# Altium schematic sheet peripherals.SchDoc
size A; SheetNumber: 2; SheetTotal: 2
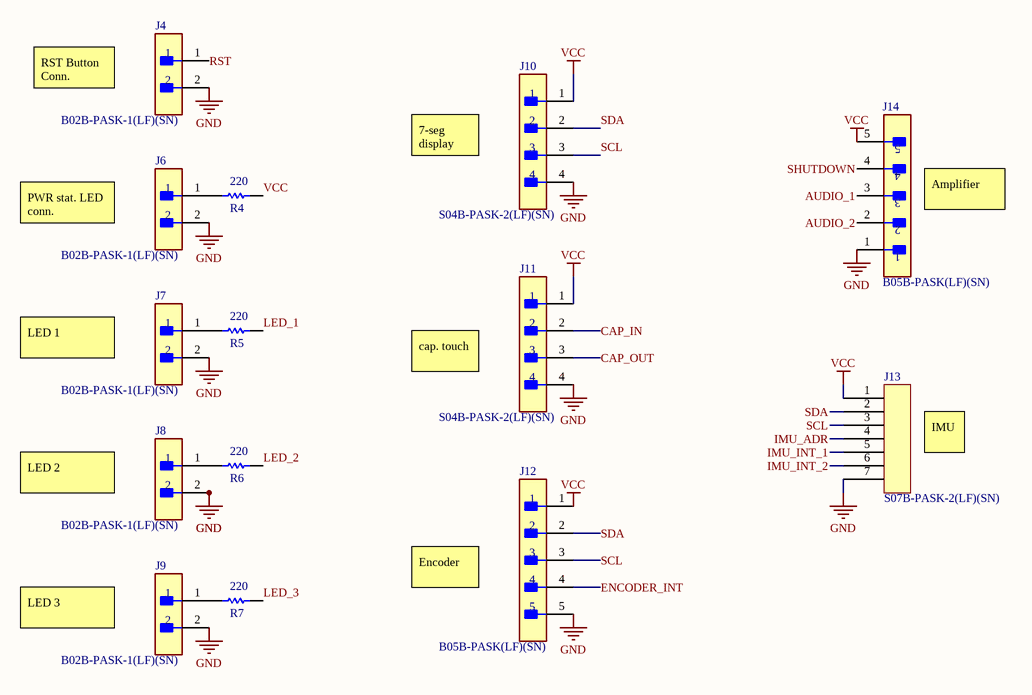
[diagram p0: peripherals.SchDoc]

## Parts
J4  B02B-PASK-1(LF)(SN)  [FP-B02B-PASK-1_LF_SN-MFG]
J6  B02B-PASK-1(LF)(SN)  [FP-B02B-PASK-1_LF_SN-MFG]
J7  B02B-PASK-1(LF)(SN)  [FP-B02B-PASK-1_LF_SN-MFG]
J8  B02B-PASK-1(LF)(SN)  [FP-B02B-PASK-1_LF_SN-MFG]
J9  B02B-PASK-1(LF)(SN)  [FP-B02B-PASK-1_LF_SN-MFG]
J10  S04B-PASK-2(LF)(SN)  [FP-S04B-PASK-2_LF_SN-MFG]
J11  S04B-PASK-2(LF)(SN)  [FP-S04B-PASK-2_LF_SN-MFG]
J12  B05B-PASK(LF)(SN)  [FP-B05B-PASK_LF_SN-MFG]
J13  S07B-PASK-2(LF)(SN)  [S07B-PASK-2(LF)(SN)-Footprint-1]
J14  B05B-PASK(LF)(SN)  [FP-B05B-PASK_LF_SN-MFG]
R4  220  [RESA60-630X240]
R5  220  [RESA60-630X240]
R6  220  [RESA60-630X240]
R7  220  [RESA60-630X240]

## Nets
GND: J4.2 J6.2 J7.2 J8.2 J9.2 J10.4 J11.4 J12.5 J13.7 J14.1
VCC: J10.1 J11.1 J12.1 J13.1 J14.5 R4.2
AUDIO_1: J14.3
AUDIO_2: J14.2
CAP_IN: J11.2
CAP_OUT: J11.3
ENCODER_INT: J12.4
IMU_ADR: J13.4
IMU_INT_1: J13.5
IMU_INT_2: J13.6
LED_1: R5.2
LED_2: R6.2
LED_3: R7.2
RST: J4.1
SCL: J10.3 J12.3 J13.3
SDA: J10.2 J12.2 J13.2
SHUTDOWN: J14.4
NetJ6_1: J6.1 R4.1
NetJ7_1: J7.1 R5.1
NetJ8_1: J8.1 R6.1
NetJ9_1: J9.1 R7.1

## Notes on the sheet
- RST Button Conn.
- 7-seg display
- PWR stat. LED conn.
- (near J14) Amplifier
- LED 1
- cap. touch
- LED 2
- (near J13) IMU
- LED 3
- Encoder

## Library data of the parts
J4 J6-J9 = CMP-17439-000415-1: CONN HEADER VERT 2POS 2MM; Number of Contacts: 2; Current Rating: 3A; Insulation Resistance: 1GR; Mated Stacking Heights: 14.9mm; Voltage Rating: 250V; Gender: Male; Pitch: 2mm; Orientation: Straight; Contact Finish - Mating: TIN; Mount: Through Hole; Contact Type: Male Pin; Number of Rows: 1; Fastening Type: Ramp; Series: PA; Connector Type: Header; Insulation Color: Natural; Flammability Rating: UL94 V-0; Material: Polybutylene; Contact Shape: Square; Contact Plating: Tin; Insulation Material: PBT; Max Operating Temperature: 85°C; Housing Color: White; Number of Positions: 2; Contact Material: Copper Alloy; Min Operating Temperature: -25°C; Lead Free: Lead Free; Contact Mating Length: 0.126inch; Termination: Solder; Packaging: Bulk; Color: Natural
J10 J11 = CMP-17439-000283-1: CONN HEADER R/A 4POS 2MM; Max Current Rating: 3A; Contact Resistance: 20mR; Max Voltage Rating (AC): 250V; Number of Positions: 4; Orientation: Right Angle; Contact Type: Male Pin; Insulation Material: PBT; Contact Shape: Square; Series: PA; Contact Mating Length: 0.126inch; Fastening Type: Ramp; Contact Material: Copper Alloy; Termination: Solder; Housing Color: White; Length: 10mm; Contact Plating: Copper; Packaging: Bulk; Max Operating Temperature: 85°C; Connector Type: Header; Number of Rows: 1; Flammability Rating: UL94 V-0; Min Operating Temperature: -25°C; Insulation Color: Natural; Current Rating: 3A; Depth: 11.7mm; Number of Contacts: 4; Mount: Through Hole; Color: Natural; Pitch: 2mm; Contact Finish - Mating: TIN; Lead Free: Lead Free; Voltage Rating: 250V
J12 J14 = CMP-17439-000143-1: CONN HEADER VERT 5POS 2MM; Number of Positions: 5; Voltage Rating: 250V; Gender: Male; Mated Stacking Heights: 14.9mm; Contact Material: Copper Alloy; Contact Type: Male Pin; Contact Finish - Mating: TIN; Insulation Material: PBT; Contact Plating: Tin; Contact Mating Length: 0.126inch; Fastening Type: Ramp; Contact Shape: Square; Packaging: Bulk; Color: Natural; Mount: Through Hole; Housing Color: White; Termination: Kinked Pin; Series: PA; Number of Rows: 1; Lead Free: Lead Free; Flammability Rating: UL94 V-0; Insulation Color: Natural; Number of Contacts: 5; Connector Type: Header; Pitch: 2mm
J13 = CMP-002-00091-1: Conn Shrouded Header HDR 7 POS 2mm Solder RA Thru-Hole Box
R4-R7 = CMP-009-00195-1: RES 1K OHM 1/4W 1% AXIAL; Resistance: 1kR; Voltage Rating (DC): 200V; Temperature Coefficient: 100ppm/°C; Lead Diameter: 0.6mm; Max Power Dissipation: 250mW; Voltage Rating: 250V; Min Operating Temperature: -55°C; Max Operating Temperature: 155°C; Case/Package: Axial; Series: MFR; Tolerance: 1%; Lead Free: Lead Free; Packaging: Bulk; Length: 0.248inch; Mount: Through Hole; Width: 6.3mm; Termination: Axial; RoHS Compliant: Yes; Package Quantity: 200; Number of Terminations: 2; Power Rating: 250mW; Resistor Type: Metal Film